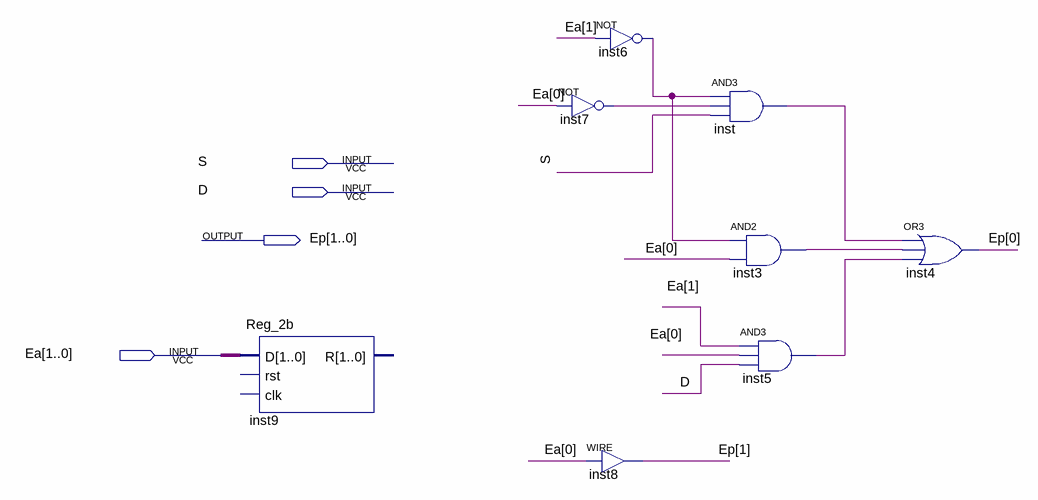
[diagram p0: schematic sheet]
// Quartus schematic LPE.bdf as structural Verilog: 8 symbols, 4 pins
module LPE (
  input  S,
  input  D,
  input  [1:0] Ea,
  output [1:0] Ep
);

  wire inst3_out, inst5_out, inst6_out, inst7_out, inst_out;

  Reg_2b inst9 (.D(Ea));  // open: rst, clk, R
  not inst7 (inst7_out, Ea[0]);
  not inst6 (inst6_out, Ea[1]);
  assign Ep[1] = Ea[0];  // WIRE inst8
  and inst (inst_out, inst6_out, inst7_out, S);
  and inst3 (inst3_out, inst6_out, Ea[0]);
  and inst5 (inst5_out, Ea[1], Ea[0], D);
  or inst4 (Ep[0], inst_out, inst3_out, inst5_out);
endmodule
